# Altium project flatsat_platform.PrjPcb (part 1 of 2)
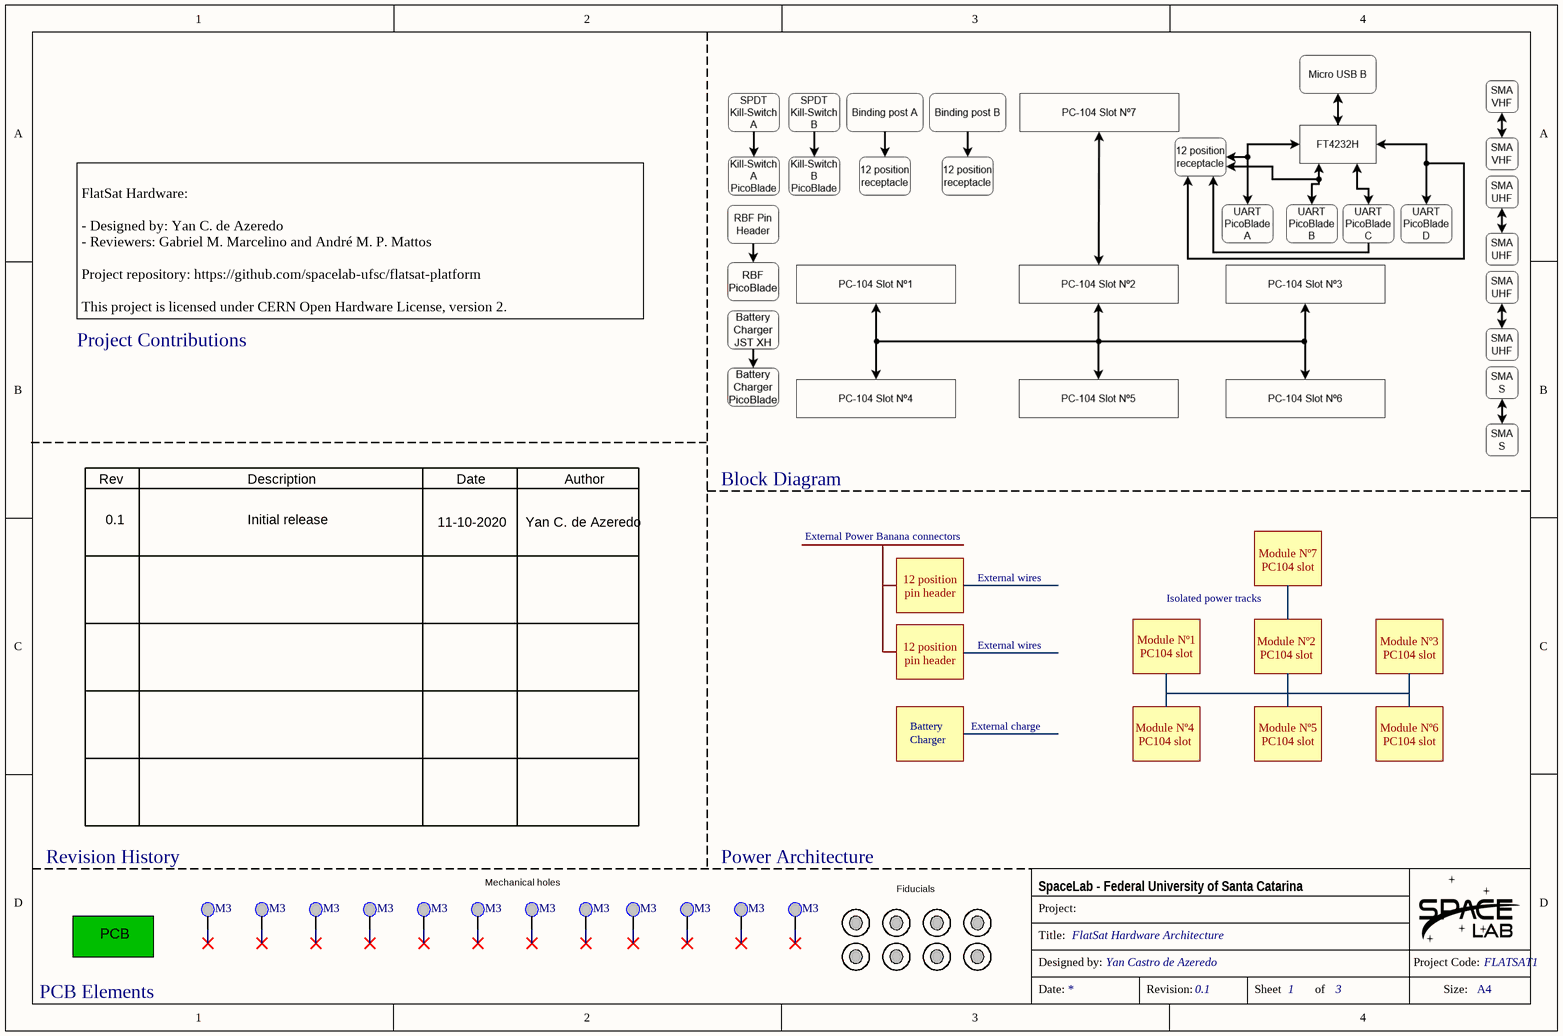
[diagram p0: 0_architecture.SchDoc]
DesignedBy: Yan Castro de Azeredo; ProjectCode: FLATSAT1; Revision: 0.1
3 sheets, 109 parts. Net scope: global (net labels, ports and power ports of the same name join across sheets).
Board file: board_layout.PcbDoc
Sheets:
  0_architecture.SchDoc
  1_flatsat_interfaces.SchDoc
  2_usb_debug.SchDoc

## Sheet 0_architecture.SchDoc: FlatSat Hardware Architecture
size A4; Organization: UFSC; DocumentNumber: 1; SheetNumber: 1; SheetTotal: 3; ProjectCode: FLATSAT1

### Parts
_PCB1  PCB spec  (value not drawn)  (no BOM)
FD1  Fiducial 1.3  [Fiducial 1.3mm]  (value not drawn)  (no BOM)
FD2  Fiducial 1.3  [Fiducial 1.3mm]  (value not drawn)  (no BOM)
FD3  Fiducial 1.3  [Fiducial 1.3mm]  (value not drawn)  (no BOM)
FD4  Fiducial 1.3  [Fiducial 1.3mm]  (value not drawn)  (no BOM)
FD5  Fiducial 1.3  [Fiducial 1.3mm]  (value not drawn)  (no BOM)
FD6  Fiducial 1.3  [Fiducial 1.3mm]  (value not drawn)  (no BOM)
FD7  Fiducial 1.3  [Fiducial 1.3mm]  (value not drawn)  (no BOM)
FD8  Fiducial 1.3  [Fiducial 1.3mm]  (value not drawn)  (no BOM)
MEC1  M3  [M3 hole]  (no BOM)
MEC2  M3  [M3 hole]  (no BOM)
MEC3  M3  [M3 hole]  (no BOM)
MEC4  M3  [M3 hole]  (no BOM)
MEC5  M3  [M3 hole]  (no BOM)
MEC6  M3  [M3 hole]  (no BOM)
MEC7  M3  [M3 hole]  (no BOM)
MEC8  M3  [M3 hole]  (no BOM)
MEC9  M3  [M3 hole]  (no BOM)
MEC10  M3  [M3 hole]  (no BOM)
MEC11  M3  [M3 hole]  (no BOM)
MEC12  M3  [M3 hole]  (no BOM)

### Nets

Not connected (* = marked no-connect by the designer): MEC1 0*; MEC2 0*; MEC3 0*; MEC4 0*; MEC5 0*; MEC6 0*; MEC7 0*; MEC8 0*; MEC9 0*; MEC10 0*; MEC11 0*; MEC12 0*

### Notes on the sheet
- FlatSat Hardware:
  - Designed by: Yan C. de Azeredo
  - Reviewers: Gabriel M. Marcelino and André M. P. Mattos
  Project repository: https://github.com/spacelab-ufsc/flatsat-platform
  This project is licensed under CERN Open Hardware License, version 2.
- Project Contributions
- Rev
- Description
- Date
- Author
- Block Diagram
- 0.1
- Initial release
- 11-10-2020
- Yan C. de Azeredo
- External Power Banana connectors
- External wires
- Module Nº7
  PC104 slot
- 12 position
  pin header
- Module Nº1
  PC104 slot
- Isolated power tracks
- Module Nº2
  PC104 slot
- Module Nº3
  PC104 slot
- Battery
- Charger
- External charge
- Module Nº4
  PC104 slot
- Module Nº5
  PC104 slot
- Module Nº6
  PC104 slot
- Revision History
- Mechanical holes
- Power Architecture
- Fiducials
- (near _PCB1) PCB Elements
- Project:
- SpaceLab - Federal University of Santa Catarina
- Title:
- Designed by:
- Project Code:
- Date:
- Revision:
- Sheet
- of
- Size:
- A4

### Library data of the parts
_PCB1 = PCB
FD1-FD8 = Fiducial 1.3: Fiducial 1.3mm
MEC1-MEC12 = M3 hole

## Sheet 1_flatsat_interfaces.SchDoc: FlatSat Main Interfaces and Connectors
size A2; ProjectCode: FLATSAT1; DocumentNumber: 2; SheetNumber: 2; SheetTotal: 3
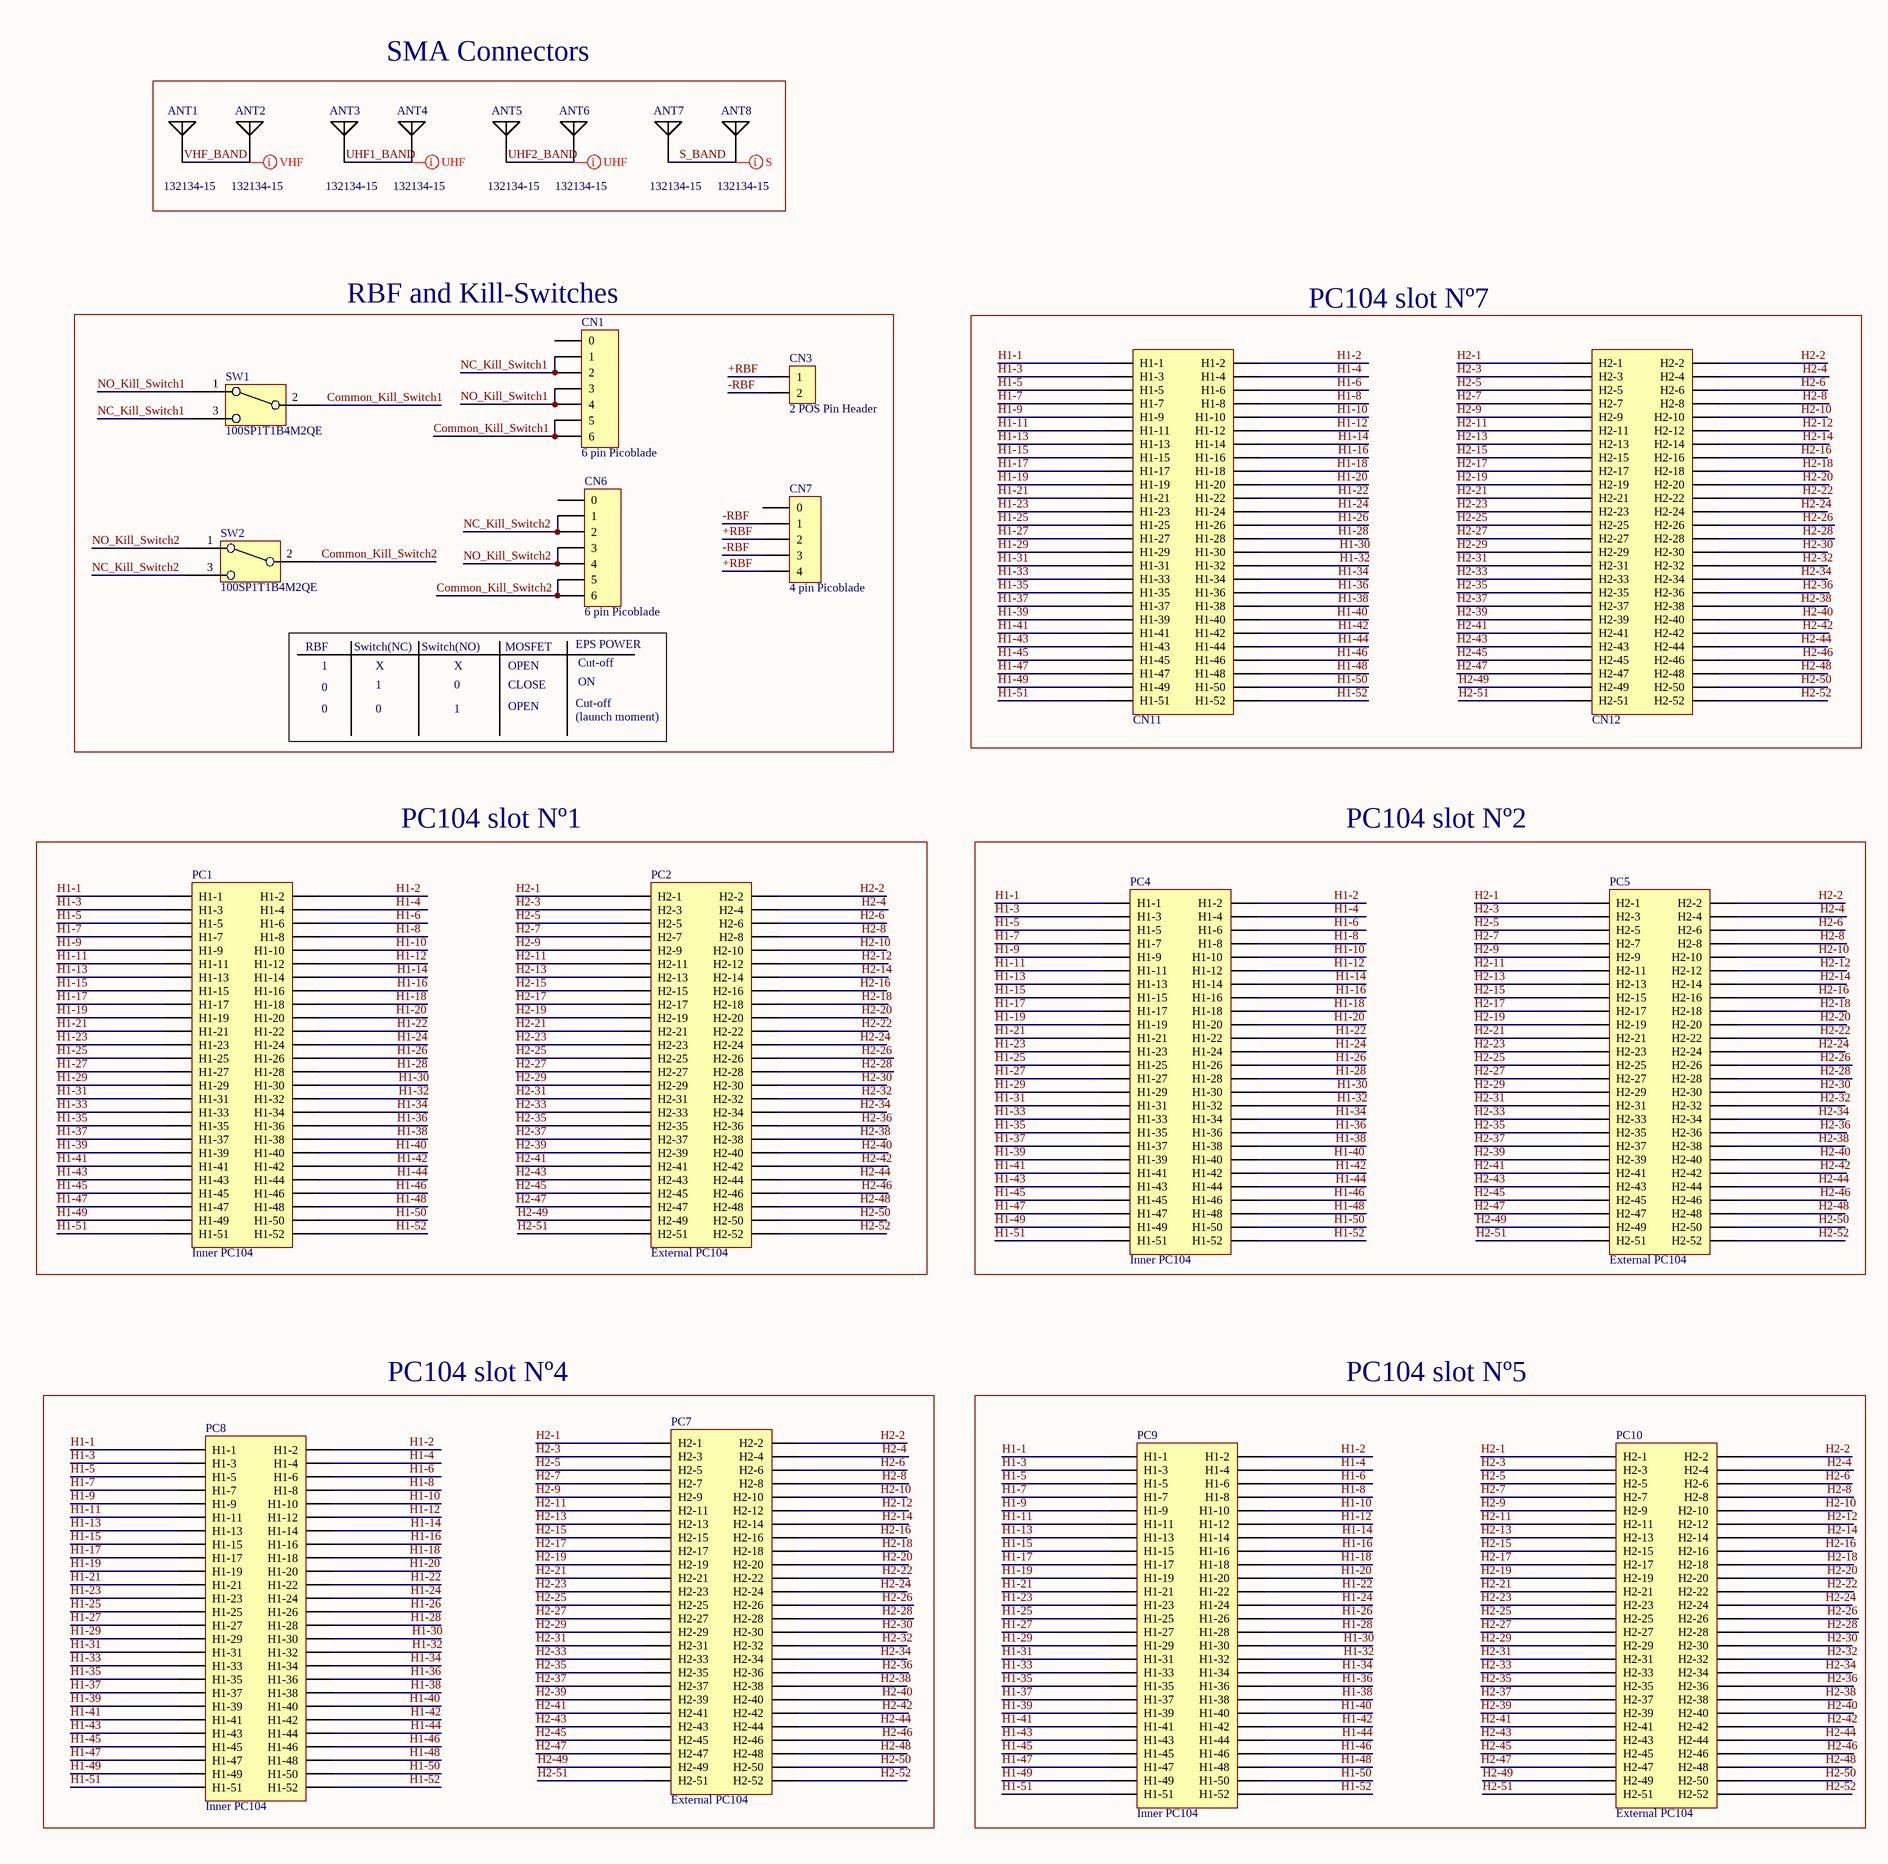
[diagram p1: 1_flatsat_interfaces.SchDoc, left]
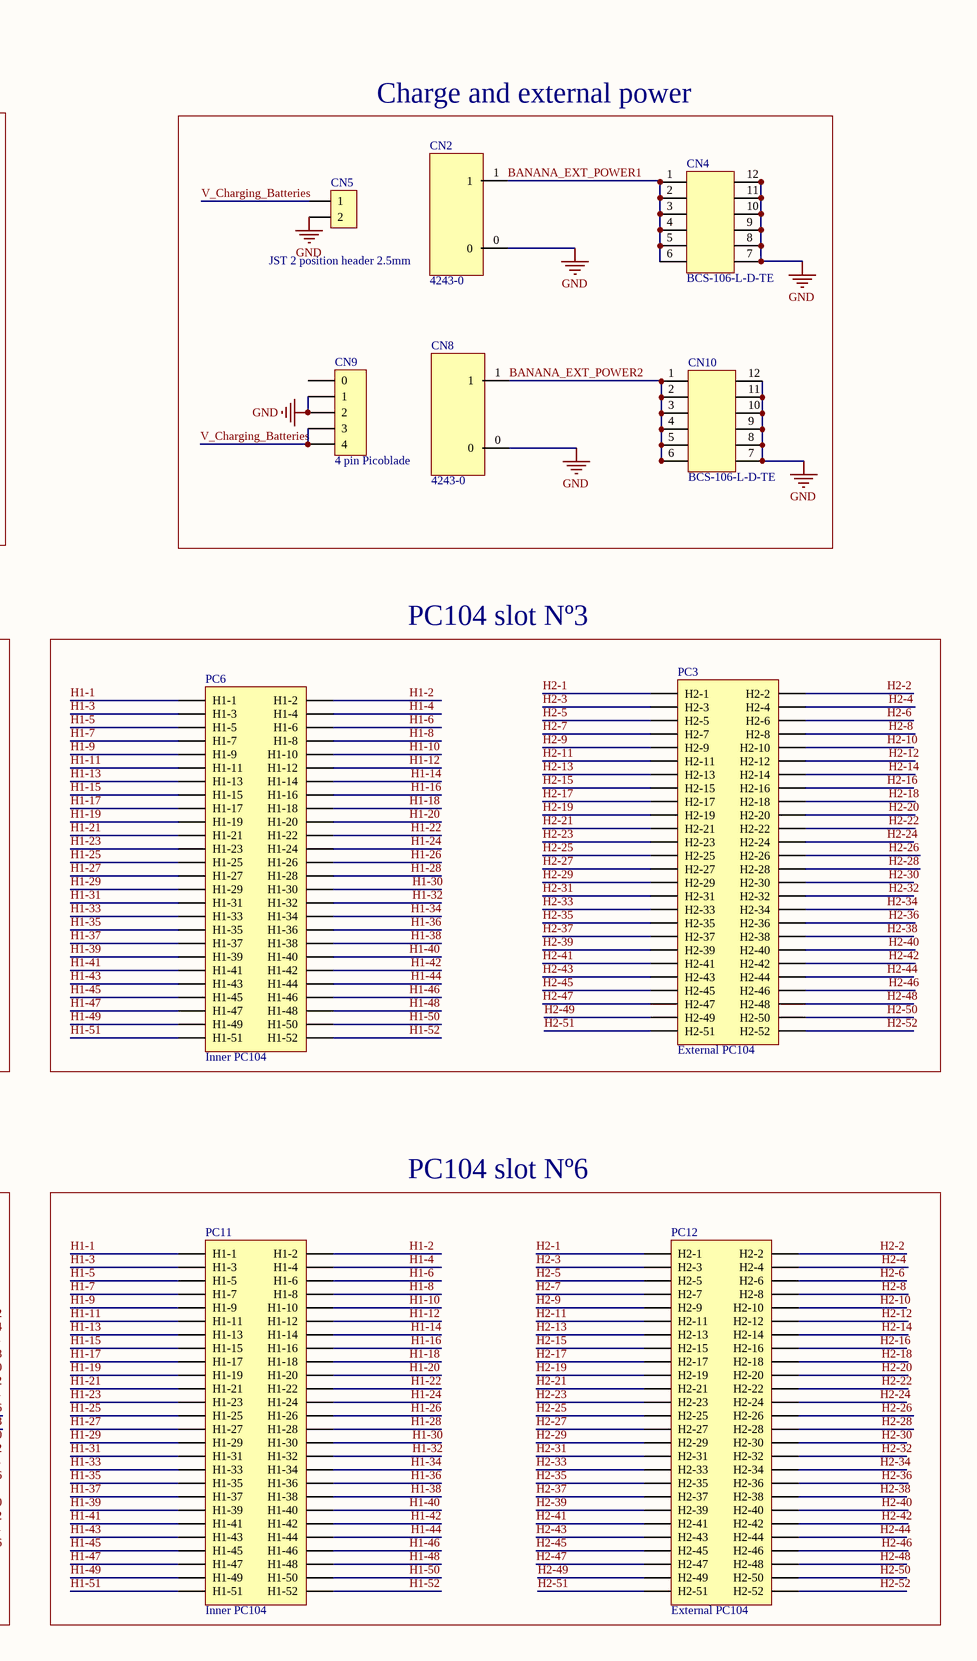
[diagram p2: 1_flatsat_interfaces.SchDoc, right]

### Parts
ANT1  132134-15  [132134-15]
ANT2  132134-15  [132134-15]
ANT3  132134-15  [132134-15]
ANT4  132134-15  [132134-15]
ANT5  132134-15  [132134-15]
ANT6  132134-15  [132134-15]
ANT7  132134-15  [132134-15]
ANT8  132134-15  [132134-15]
CN1  6 pin Picoblade  [PICO BLADE 0533980671]
CN2  4243-0  [4243-0]
CN3  2 POS Pin Header  [CONN HEADER VERT 2POS 2.54mm]
CN4  BCS-106-L-D-TE  [BCS-106-L-D-TE]
CN5  JST 2 position header 2.5mm  [B2B-XH-A-M(LF)(SN)]
CN6  6 pin Picoblade  [PICO BLADE 0533980671]
CN7  4 pin Picoblade  [PICO BLADE 0533980471]
CN8  4243-0  [4243-0]
CN9  4 pin Picoblade  [PICO BLADE 0533980471]
CN10  BCS-106-L-D-TE  [BCS-106-L-D-TE]
CN11  CONN RCPT 52POS 0.1 GOLD PCB  [Inner_SSW-126-01-G-D_testboard]  (value not drawn)
CN12  CONN RCPT 52POS 0.1 GOLD PCB  [external_SSW-126-01-G-D _testboard]  (value not drawn)
PC1  Inner PC104  [Inner_SSW-126-01-G-D]
PC2  External PC104  [external_SSW-126-01-G-D]
PC3  External PC104  [external_SSW-126-01-G-D]
PC4  Inner PC104  [Inner_SSW-126-01-G-D]
PC5  External PC104  [external_SSW-126-01-G-D]
PC6  Inner PC104  [Inner_SSW-126-01-G-D]
PC7  External PC104  [external_SSW-126-01-G-D]
PC8  Inner PC104  [Inner_SSW-126-01-G-D]
PC9  Inner PC104  [Inner_SSW-126-01-G-D]
PC10  External PC104  [external_SSW-126-01-G-D]
PC11  Inner PC104  [Inner_SSW-126-01-G-D]
PC12  External PC104  [external_SSW-126-01-G-D]
SW1  100SP1T1B4M2QE  [Toggle Switch SPDT Through Hole]
SW2  100SP1T1B4M2QE  [Toggle Switch SPDT Through Hole]

### Blocks framed on the sheet
SMA Connectors: ANT1-ANT8
RBF and Kill-Switches: CN1 CN3 CN6 CN7 SW1 SW2
PC104 slot Nº7: CN11 CN12
Charge and external power: CN2 CN4 CN5 CN8-CN10
PC104 slot Nº1: PC1 PC2
PC104 slot Nº2: PC4 PC5
PC104 slot Nº3: PC3 PC6
PC104 slot Nº4: PC7 PC8
PC104 slot Nº5: PC9 PC10
PC104 slot Nº6: PC11 PC12

### Nets
GND: CN2.0 CN4.7 CN4.8 CN4.9 CN4.10 CN4.11 CN4.12 CN5.2 CN8.0 CN9.1 CN9.2 CN10.7 CN10.8 CN10.9 CN10.10 CN10.11 CN10.12
+RBF: CN3.1 CN7.2 CN7.4
-RBF: CN3.2 CN7.1 CN7.3
BANANA_EXT_POWER1: CN2.1 CN4.1 CN4.2 CN4.3 CN4.4 CN4.5 CN4.6
BANANA_EXT_POWER2: CN8.1 CN10.1 CN10.2 CN10.3 CN10.4 CN10.5 CN10.6
Common_Kill_Switch1: CN1.5 CN1.6 SW1.2(C)
Common_Kill_Switch2: CN6.5 CN6.6 SW2.2(C)
H1-1: CN11.H1-1 PC1.H1-1 PC4.H1-1 PC6.H1-1 PC8.H1-1 PC9.H1-1 PC11.H1-1
H1-2: CN11.H1-2 PC1.H1-2 PC4.H1-2 PC6.H1-2 PC8.H1-2 PC9.H1-2 PC11.H1-2
H1-3: CN11.H1-3 PC1.H1-3 PC4.H1-3 PC6.H1-3 PC8.H1-3 PC9.H1-3 PC11.H1-3
H1-4: CN11.H1-4 PC1.H1-4 PC4.H1-4 PC6.H1-4 PC8.H1-4 PC9.H1-4 PC11.H1-4
H1-5: CN11.H1-5 PC1.H1-5 PC4.H1-5 PC6.H1-5 PC8.H1-5 PC9.H1-5 PC11.H1-5
H1-6: CN11.H1-6 PC1.H1-6 PC4.H1-6 PC6.H1-6 PC8.H1-6 PC9.H1-6 PC11.H1-6
H1-7: CN11.H1-7 PC1.H1-7 PC4.H1-7 PC6.H1-7 PC8.H1-7 PC9.H1-7 PC11.H1-7
H1-8: CN11.H1-8 PC1.H1-8 PC4.H1-8 PC6.H1-8 PC8.H1-8 PC9.H1-8 PC11.H1-8
H1-9: CN11.H1-9 PC1.H1-9 PC4.H1-9 PC6.H1-9 PC8.H1-9 PC9.H1-9 PC11.H1-9
H1-10: CN11.H1-10 PC1.H1-10 PC4.H1-10 PC6.H1-10 PC8.H1-10 PC9.H1-10 PC11.H1-10
H1-11: CN11.H1-11 PC1.H1-11 PC4.H1-11 PC6.H1-11 PC8.H1-11 PC9.H1-11 PC11.H1-11
H1-12: CN11.H1-12 PC1.H1-12 PC4.H1-12 PC6.H1-12 PC8.H1-12 PC9.H1-12 PC11.H1-12
H1-13: CN11.H1-13 PC1.H1-13 PC4.H1-13 PC6.H1-13 PC8.H1-13 PC9.H1-13 PC11.H1-13
H1-14: CN11.H1-14 PC1.H1-14 PC4.H1-14 PC6.H1-14 PC8.H1-14 PC9.H1-14 PC11.H1-14
H1-15: CN11.H1-15 PC1.H1-15 PC4.H1-15 PC6.H1-15 PC8.H1-15 PC9.H1-15 PC11.H1-15
H1-16: CN11.H1-16 PC1.H1-16 PC4.H1-16 PC6.H1-16 PC8.H1-16 PC9.H1-16 PC11.H1-16
H1-17: CN11.H1-17 PC1.H1-17 PC4.H1-17 PC6.H1-17 PC8.H1-17 PC9.H1-17 PC11.H1-17
H1-18: CN11.H1-18 PC1.H1-18 PC4.H1-18 PC6.H1-18 PC8.H1-18 PC9.H1-18 PC11.H1-18
H1-19: CN11.H1-19 PC1.H1-19 PC4.H1-19 PC6.H1-19 PC8.H1-19 PC9.H1-19 PC11.H1-19
H1-20: CN11.H1-20 PC1.H1-20 PC4.H1-20 PC6.H1-20 PC8.H1-20 PC9.H1-20 PC11.H1-20
H1-21: CN11.H1-21 PC1.H1-21 PC4.H1-21 PC6.H1-21 PC8.H1-21 PC9.H1-21 PC11.H1-21
H1-22: CN11.H1-22 PC1.H1-22 PC4.H1-22 PC6.H1-22 PC8.H1-22 PC9.H1-22 PC11.H1-22
H1-23: CN11.H1-23 PC1.H1-23 PC4.H1-23 PC6.H1-23 PC8.H1-23 PC9.H1-23 PC11.H1-23
H1-24: CN11.H1-24 PC1.H1-24 PC4.H1-24 PC6.H1-24 PC8.H1-24 PC9.H1-24 PC11.H1-24
H1-25: CN11.H1-25 PC1.H1-25 PC4.H1-25 PC6.H1-25 PC8.H1-25 PC9.H1-25 PC11.H1-25
H1-26: CN11.H1-26 PC1.H1-26 PC4.H1-26 PC6.H1-26 PC8.H1-26 PC9.H1-26 PC11.H1-26
H1-27: CN11.H1-27 PC1.H1-27 PC4.H1-27 PC6.H1-27 PC8.H1-27 PC9.H1-27 PC11.H1-27
H1-28: CN11.H1-28 PC1.H1-28 PC4.H1-28 PC6.H1-28 PC8.H1-28 PC9.H1-28 PC11.H1-28
H1-29: CN11.H1-29 PC1.H1-29 PC4.H1-29 PC6.H1-29 PC8.H1-29 PC9.H1-29 PC11.H1-29
H1-30: CN11.H1-30 PC1.H1-30 PC4.H1-30 PC6.H1-30 PC8.H1-30 PC9.H1-30 PC11.H1-30
H1-31: CN11.H1-31 PC1.H1-31 PC4.H1-31 PC6.H1-31 PC8.H1-31 PC9.H1-31 PC11.H1-31
H1-32: CN11.H1-32 PC1.H1-32 PC4.H1-32 PC6.H1-32 PC8.H1-32 PC9.H1-32 PC11.H1-32
H1-33: CN11.H1-33 PC1.H1-33 PC4.H1-33 PC6.H1-33 PC8.H1-33 PC9.H1-33 PC11.H1-33
H1-34: CN11.H1-34 PC1.H1-34 PC4.H1-34 PC6.H1-34 PC8.H1-34 PC9.H1-34 PC11.H1-34
H1-35: CN11.H1-35 PC1.H1-35 PC4.H1-35 PC6.H1-35 PC8.H1-35 PC9.H1-35 PC11.H1-35
H1-36: CN11.H1-36 PC1.H1-36 PC4.H1-36 PC6.H1-36 PC8.H1-36 PC9.H1-36 PC11.H1-36
H1-37: CN11.H1-37 PC1.H1-37 PC4.H1-37 PC6.H1-37 PC8.H1-37 PC9.H1-37 PC11.H1-37
H1-38: CN11.H1-38 PC1.H1-38 PC4.H1-38 PC6.H1-38 PC8.H1-38 PC9.H1-38 PC11.H1-38
H1-39: CN11.H1-39 PC1.H1-39 PC4.H1-39 PC6.H1-39 PC8.H1-39 PC9.H1-39 PC11.H1-39
H1-40: CN11.H1-40 PC1.H1-40 PC4.H1-40 PC6.H1-40 PC8.H1-40 PC9.H1-40 PC11.H1-40
H1-41: CN11.H1-41 PC1.H1-41 PC4.H1-41 PC6.H1-41 PC8.H1-41 PC9.H1-41 PC11.H1-41
H1-42: CN11.H1-42 PC1.H1-42 PC4.H1-42 PC6.H1-42 PC8.H1-42 PC9.H1-42 PC11.H1-42
H1-43: CN11.H1-43 PC1.H1-43 PC4.H1-43 PC6.H1-43 PC8.H1-43 PC9.H1-43 PC11.H1-43
H1-44: CN11.H1-44 PC1.H1-44 PC4.H1-44 PC6.H1-44 PC8.H1-44 PC9.H1-44 PC11.H1-44
H1-45: CN11.H1-45 PC1.H1-45 PC4.H1-45 PC6.H1-45 PC8.H1-45 PC9.H1-45 PC11.H1-45
H1-46: CN11.H1-46 PC1.H1-46 PC4.H1-46 PC6.H1-46 PC8.H1-46 PC9.H1-46 PC11.H1-46
H1-47: CN11.H1-47 PC1.H1-47 PC4.H1-47 PC6.H1-47 PC8.H1-47 PC9.H1-47 PC11.H1-47
H1-48: CN11.H1-48 PC1.H1-48 PC4.H1-48 PC6.H1-48 PC8.H1-48 PC9.H1-48 PC11.H1-48
H1-49: CN11.H1-49 PC1.H1-49 PC4.H1-49 PC6.H1-49 PC8.H1-49 PC9.H1-49 PC11.H1-49
H1-50: CN11.H1-50 PC1.H1-50 PC4.H1-50 PC6.H1-50 PC8.H1-50 PC9.H1-50 PC11.H1-50
H1-51: CN11.H1-51 PC1.H1-51 PC4.H1-51 PC6.H1-51 PC8.H1-51 PC9.H1-51 PC11.H1-51
H1-52: CN11.H1-52 PC1.H1-52 PC4.H1-52 PC6.H1-52 PC8.H1-52 PC9.H1-52 PC11.H1-52
H2-1: CN12.H2-1 PC2.H2-1 PC3.H2-1 PC5.H2-1 PC7.H2-1 PC10.H2-1 PC12.H2-1
H2-2: CN12.H2-2 PC2.H2-2 PC3.H2-2 PC5.H2-2 PC7.H2-2 PC10.H2-2 PC12.H2-2
H2-3: CN12.H2-3 PC2.H2-3 PC3.H2-3 PC5.H2-3 PC7.H2-3 PC10.H2-3 PC12.H2-3
H2-4: CN12.H2-4 PC2.H2-4 PC3.H2-4 PC5.H2-4 PC7.H2-4 PC10.H2-4 PC12.H2-4
H2-5: CN12.H2-5 PC2.H2-5 PC3.H2-5 PC5.H2-5 PC7.H2-5 PC10.H2-5 PC12.H2-5
H2-6: CN12.H2-6 PC2.H2-6 PC3.H2-6 PC5.H2-6 PC7.H2-6 PC10.H2-6 PC12.H2-6
H2-7: CN12.H2-7 PC2.H2-7 PC3.H2-7 PC5.H2-7 PC7.H2-7 PC10.H2-7 PC12.H2-7
H2-8: CN12.H2-8 PC2.H2-8 PC3.H2-8 PC5.H2-8 PC7.H2-8 PC10.H2-8 PC12.H2-8
H2-9: CN12.H2-9 PC2.H2-9 PC3.H2-9 PC5.H2-9 PC7.H2-9 PC10.H2-9 PC12.H2-9
H2-10: CN12.H2-10 PC2.H2-10 PC3.H2-10 PC5.H2-10 PC7.H2-10 PC10.H2-10 PC12.H2-10
H2-11: CN12.H2-11 PC2.H2-11 PC3.H2-11 PC5.H2-11 PC7.H2-11 PC10.H2-11 PC12.H2-11
H2-12: CN12.H2-12 PC2.H2-12 PC3.H2-12 PC5.H2-12 PC7.H2-12 PC10.H2-12 PC12.H2-12
H2-13: CN12.H2-13 PC2.H2-13 PC3.H2-13 PC5.H2-13 PC7.H2-13 PC10.H2-13 PC12.H2-13
H2-14: CN12.H2-14 PC2.H2-14 PC3.H2-14 PC5.H2-14 PC7.H2-14 PC10.H2-14 PC12.H2-14
H2-15: CN12.H2-15 PC2.H2-15 PC3.H2-15 PC5.H2-15 PC7.H2-15 PC10.H2-15 PC12.H2-15
H2-16: CN12.H2-16 PC2.H2-16 PC3.H2-16 PC5.H2-16 PC7.H2-16 PC10.H2-16 PC12.H2-16
H2-17: CN12.H2-17 PC2.H2-17 PC3.H2-17 PC5.H2-17 PC7.H2-17 PC10.H2-17 PC12.H2-17
H2-18: CN12.H2-18 PC2.H2-18 PC3.H2-18 PC5.H2-18 PC7.H2-18 PC10.H2-18 PC12.H2-18
H2-19: CN12.H2-19 PC2.H2-19 PC3.H2-19 PC5.H2-19 PC7.H2-19 PC10.H2-19 PC12.H2-19
H2-20: CN12.H2-20 PC2.H2-20 PC3.H2-20 PC5.H2-20 PC7.H2-20 PC10.H2-20 PC12.H2-20
H2-21: CN12.H2-21 PC2.H2-21 PC3.H2-21 PC5.H2-21 PC7.H2-21 PC10.H2-21 PC12.H2-21
H2-22: CN12.H2-22 PC2.H2-22 PC3.H2-22 PC5.H2-22 PC7.H2-22 PC10.H2-22 PC12.H2-22
H2-23: CN12.H2-23 PC2.H2-23 PC3.H2-23 PC5.H2-23 PC7.H2-23 PC10.H2-23 PC12.H2-23
H2-24: CN12.H2-24 PC2.H2-24 PC3.H2-24 PC5.H2-24 PC7.H2-24 PC10.H2-24 PC12.H2-24
H2-25: CN12.H2-25 PC2.H2-25 PC3.H2-25 PC5.H2-25 PC7.H2-25 PC10.H2-25 PC12.H2-25
H2-26: CN12.H2-26 PC2.H2-26 PC3.H2-26 PC5.H2-26 PC7.H2-26 PC10.H2-26 PC12.H2-26
H2-27: CN12.H2-27 PC2.H2-27 PC3.H2-27 PC5.H2-27 PC7.H2-27 PC10.H2-27 PC12.H2-27
H2-28: CN12.H2-28 PC2.H2-28 PC3.H2-28 PC5.H2-28 PC7.H2-28 PC10.H2-28 PC12.H2-28
H2-29: CN12.H2-29 PC2.H2-29 PC3.H2-29 PC5.H2-29 PC7.H2-29 PC10.H2-29 PC12.H2-29
H2-30: CN12.H2-30 PC2.H2-30 PC3.H2-30 PC5.H2-30 PC7.H2-30 PC10.H2-30 PC12.H2-30
H2-31: CN12.H2-31 PC2.H2-31 PC3.H2-31 PC5.H2-31 PC7.H2-31 PC10.H2-31 PC12.H2-31
H2-32: CN12.H2-32 PC2.H2-32 PC3.H2-32 PC5.H2-32 PC7.H2-32 PC10.H2-32 PC12.H2-32
H2-33: CN12.H2-33 PC2.H2-33 PC3.H2-33 PC5.H2-33 PC7.H2-33 PC10.H2-33 PC12.H2-33
H2-34: CN12.H2-34 PC2.H2-34 PC3.H2-34 PC5.H2-34 PC7.H2-34 PC10.H2-34 PC12.H2-34
H2-35: CN12.H2-35 PC2.H2-35 PC3.H2-35 PC5.H2-35 PC7.H2-35 PC10.H2-35 PC12.H2-35
H2-36: CN12.H2-36 PC2.H2-36 PC3.H2-36 PC5.H2-36 PC7.H2-36 PC10.H2-36 PC12.H2-36
H2-37: CN12.H2-37 PC2.H2-37 PC3.H2-37 PC5.H2-37 PC7.H2-37 PC10.H2-37 PC12.H2-37
H2-38: CN12.H2-38 PC2.H2-38 PC3.H2-38 PC5.H2-38 PC7.H2-38 PC10.H2-38 PC12.H2-38
H2-39: CN12.H2-39 PC2.H2-39 PC3.H2-39 PC5.H2-39 PC7.H2-39 PC10.H2-39 PC12.H2-39
H2-40: CN12.H2-40 PC2.H2-40 PC3.H2-40 PC5.H2-40 PC7.H2-40 PC10.H2-40 PC12.H2-40
H2-41: CN12.H2-41 PC2.H2-41 PC3.H2-41 PC5.H2-41 PC7.H2-41 PC10.H2-41 PC12.H2-41
H2-42: CN12.H2-42 PC2.H2-42 PC3.H2-42 PC5.H2-42 PC7.H2-42 PC10.H2-42 PC12.H2-42
H2-43: CN12.H2-43 PC2.H2-43 PC3.H2-43 PC5.H2-43 PC7.H2-43 PC10.H2-43 PC12.H2-43
H2-44: CN12.H2-44 PC2.H2-44 PC3.H2-44 PC5.H2-44 PC7.H2-44 PC10.H2-44 PC12.H2-44
H2-45: CN12.H2-45 PC2.H2-45 PC3.H2-45 PC5.H2-45 PC7.H2-45 PC10.H2-45 PC12.H2-45
H2-46: CN12.H2-46 PC2.H2-46 PC3.H2-46 PC5.H2-46 PC7.H2-46 PC10.H2-46 PC12.H2-46
H2-47: CN12.H2-47 PC2.H2-47 PC3.H2-47 PC5.H2-47 PC7.H2-47 PC10.H2-47 PC12.H2-47
H2-48: CN12.H2-48 PC2.H2-48 PC3.H2-48 PC5.H2-48 PC7.H2-48 PC10.H2-48 PC12.H2-48
H2-49: CN12.H2-49 PC2.H2-49 PC3.H2-49 PC5.H2-49 PC7.H2-49 PC10.H2-49 PC12.H2-49
H2-50: CN12.H2-50 PC2.H2-50 PC3.H2-50 PC5.H2-50 PC7.H2-50 PC10.H2-50 PC12.H2-50
H2-51: CN12.H2-51 PC2.H2-51 PC3.H2-51 PC5.H2-51 PC7.H2-51 PC10.H2-51 PC12.H2-51
H2-52: CN12.H2-52 PC2.H2-52 PC3.H2-52 PC5.H2-52 PC7.H2-52 PC10.H2-52 PC12.H2-52
NC_Kill_Switch1: CN1.1 CN1.2 SW1.3(NO)
NC_Kill_Switch2: CN6.1 CN6.2 SW2.3(NO)
NO_Kill_Switch1: CN1.3 CN1.4 SW1.1(NC)
NO_Kill_Switch2: CN6.3 CN6.4 SW2.1(NC)
S_BAND: ANT7.1 ANT8.1
UHF1_BAND: ANT3.1 ANT4.1
UHF2_BAND: ANT5.1 ANT6.1
V_Charging_Batteries: CN5.1 CN9.3 CN9.4
VHF_BAND: ANT1.1 ANT2.1

Not connected (* = marked no-connect by the designer): CN1 0; CN6 0; CN7 0; CN9 0

### Layout directives
net class VHF: VHF_BAND
net class UHF: UHF1_BAND, UHF2_BAND
net class S: S_BAND

### Notes on the sheet
- RBF
- 1
- 0
- Switch(NC)
- X
- Switch(NO)
- MOSFET
- OPEN
- CLOSE
- (near CN6) EPS POWER
- Cut-off
- ON
- (launch moment)
- Title:
- Project:
- SpaceLab - Federal University of Santa Catarina
- Date:
- Engineer:
- Revision:
- Sheet
- of
- Project Code:
- Size:
- A2

### Library data of the parts
ANT1-ANT8 = 132134-15: RF COAXIAL, SMA, STRAIGHT JACK, PCB; Connector Type:SMA Coaxial; Connector Body Style:Straight Jack; Coaxial Termination:Solder; Impedance:50ohm; Coaxial Cable Types:-; Contact Material:Brass; Contact Plating:Gold Plated Contacts; Body Material: Brass; Body Plating: Gold; Dielectric Material: PTFE; Connector Type: SMA,Socket; Max Frequency: 12.4GHz; Polarity: Standard; Impedance: 50R; Mating Cycles: 500; Mount Type: *; Manufacturer: *; Supplier 1: Digi-Key; Manufacturer Part Number: 132134-15; RoHS: Yes; Category: RF / Coaxial Connectors; Stock 1: 25238; Pricing 1: 1=9.73000, 10=9.30600, 25=8.46000, 50=8.03700, 100=7.82550, 250=6.97952, 500=6.55650, 1000=5.79510, 2500=5.49900 (USD); Mount: Surface Mount,Through Hole; Case/Package: SMA; Housing Color: Gold; Contact Material: Copper; Contact Plating: Gold; Min Operating Temperature: -65°C; Max Operating Temperature: 165°C; Termination: Solder; Orientation: Straight; Package Quantity: 1; Fastening Type: Threaded; Packaging: Bulk; ComponentLink1URL: https://datasheet.ciiva.com/646/132134-15-646945.pdf?src-supplier=Digi-Key; ComponentLink1Description: https://datasheet.ciiva.com/646/132134-15-646945.pdf?src-supplier=Digi-Key; ComponentLink2URL: https://datasheet.ciiva.com/24241/132134-15-customer-drawing-24241080.pdf?src-supplier=Mouser; ComponentLink2Description: https://datasheet.ciiva.com/24241/132134-15-customer-drawing-24241080.pdf?src-supplier=Mouser; Value: *; Supplier Part Number 1: ACX1962-ND
CN1 CN6 = 53398-0671: 1.25mm Pitch PicoBlade™ Header, Surface Mount, Vertical, 6 Circuits; Manufacturer: Molex; Body Plating: Tin; Contact Resistance: 20mR; Voltage Rating: 125V; Current Rating: 1A; Number of Positions: 6; Insulation Resistance: 100MR; Gender: Male; Glow Wire Compliant: Non-compliant; Supplier 1: Digi-Key; Supplier Part Number 1: WM7610DKR-ND; Stock 1: 21086; Pricing 1: 1=1.39, 10=1.26, 100=1.0802, 500=0.90014 (USD); Mount: Surface Mount; Color: Natural; Contact Plating: Tin; Contact Material: Bronze,Tin; Housing Color: Natural; Housing Material: Nylon; Min Operating Temperature: -40°C; Max Operating Temperature: 85°C; Packaging: Tape and Reel; Number of Rows: 1; Voltage Rating (AC): 125V; Package Quantity: 1000; Termination: Solder; Number of Contacts: 6; Working Voltage: 125V; Orientation: Vertical; Number of Circuits: 6; Voltage Rating (DC): 125V; Lead Pitch: 1.25mm; Pitch: 1.25mm; Radiation Hardening: No; REACH SVHC: Unknown; Lead Free: Lead Free; Flammability Rating: UL94 V-0; ComponentLink1URL: https://www.molex.com/pdm_docs/sd/533980671_sd.pdf?src-supplier=Digi-Key; ComponentLink1Description: https://www.molex.com/pdm_docs/sd/533980671_sd.pdf?src-supplier=Digi-Key; Supplier 2: Mouser; Supplier Part Number 2: 538-53398-0671; Stock 2: 26; Pricing 2: 1=1.15, 10=1.01, 100=0.864, 500=0.727, 1000=0.427, 2000=0.374 (USD); Manufacturer Part Number: 53398-0671
CN2 CN8 = 4243-0: POMONA, 4243-0, Binding Post, 4243 Series, 15 A, 60 VDC, Tin Plated Contacts, Brass, Black; Manufacturer: Pomona Electronics; Voltage Rating: 2.5kV; Current Rating: 15A; Voltage Rating (DC): 60V; Voltage Rating (AC): 30V; Insulation: Insulated; Number of Ports: 2; Hole Diameter: 0.1inch; Panel Thickness: 6.35mm; Supplier 1: Digi-Key; Manufacturer Part Number: 4243-0; RoHS: Yes; Category: Connectors; Stock 1: 327; Pricing 1: 1=8.99000, 25=8.54040, 50=8.09100, 100=7.73150 (USD); Mount: Panel; Number of Pins: 1; Contact Plating: Tin,Bright; Contact Material: Brass; Color: Black,Red; Housing Material: Polycarbonate; Housing Color: Black; Body Material: Brass; Insulation Material: Polycarbonate; Package Quantity: 5; Packaging: Bulk; Termination: Turret; Orientation: Straight; Max Current Rating: 15A; Length: 30.23mm; Depth: 11.18mm; REACH SVHC: No SVHC; Lead Free: Lead Free; ComponentLink1URL: https://datasheet.ciiva.com/1453/d4243-1-01-1453890.pdf?src-supplier=Element14; ComponentLink1Description: https://datasheet.ciiva.com/1453/d4243-1-01-1453890.pdf?src-supplier=Element14; ComponentLink2URL: https://datasheet.ciiva.com/16883/70198115-16883751.pdf?src-supplier=Allied+Electronics; ComponentLink2Description: https://datasheet.ciiva.com/16883/70198115-16883751.pdf?src-supplier=Allied+Electronics; ComponentLink3URL: https://datasheet.ciiva.com/30105/d4243-1-02-30105753.pdf?src-supplier=Onlinecomponents.com; ComponentLink3Description: https://datasheet.ciiva.com/30105/d4243-1-02-30105753.pdf?src-supplier=Onlinecomponents.com; Supplier Part Number 1: 501-1126-ND
CN3 = M20-9990245: M20 HDR, PIN, SIL, VERT, 2W; Manufacturer: Harwin; Number of Contacts: 2; Current Rating: 3A; Contact Resistance: 25mR; Mating Cycles: 300; Voltage Rating (AC): 750V; Insulation Resistance: 10GR; Gender: Male; Connector Type: Male Pin; Voltage: 50V; Pitch: 2.54mm; Supplier 1: Digi-Key; Supplier Part Number 1: 952-2261-ND; Stock 1: 27298; Pricing 1: 1=0.15, 10=0.136, 100=0.0841, 500=0.0696, 1000=0.0609, 5000=0.0522, 10000=0.05075 (USD); Mount: Through Hole; Case/Package: SIL; Weight: 0.25lb; Contact Plating: Gold; Contact Material: Brass,Bronze; Color: Black; Housing Color: Black; Housing Material: Nylon; Min Operating Temperature: -40°C; Max Operating Temperature: 105°C; Number of Rows: 1; Termination: Solder; Max Current Rating: 3A; Number of Poles: 2; Package Quantity: 1000; Packaging: Bag; Number of Positions: 2; Working Voltage: 750V; Orientation: Straight; Current: 3A; Length: 5.08mm; Height: 0.12inch; Lead Pitch: 2.54mm; Width: 0.25inch; Contact Mating Length: 0.24inch; Depth: 2.54mm; Radiation Hardening: No; REACH SVHC: No SVHC; ComponentLink1URL: http://www.farnell.com/datasheets/2368211.pdf?src-supplier=Element14; ComponentLink1Description: http://www.farnell.com/datasheets/2368211.pdf?src-supplier=Element14; ComponentLink2URL: http://uk.rs-online.com/webdocs/1388/0900766b81388728.pdf?src-supplier=RSComponents; ComponentLink2Description: http://uk.rs-online.com/webdocs/1388/0900766b81388728.pdf?src-supplier=RSComponents; ComponentLink3URL: https://cdn.harwin.com/pdfs/Harwin_PC_Connectors_M20.pdf?src-supplier=Digi-Key; ComponentLink3Description: https://cdn.harwin.com/pdfs/Harwin_PC_Connectors_M20.pdf?src-supplier=Digi-Key; ComponentLink4URL: http://www.mouser.com/ds/2/181/Harwin_Product_Catalog_page_206-1134556.pdf?src-supplier=Mouser; ComponentLink4Description: http://www.mouser.com/ds/2/181/Harwin_Product_Catalog_page_206-1134556.pdf?src-supplier=Mouser; Supplier 2: Mouser; Supplier Part Number 2: 855-M20-9990245; Stock 2: 26881; Pricing 2: 1=0.14, 10=0.083, 100=0.069, 1000=0.06, 2000=0.052, 10000=0.05 (USD); Manufacturer Part Number: M20-9990245
CN4 CN10 = BCS-106-L-D-TE: CONN RCPT 12POS 0.1 GOLD PCB; Manufacturer: Samtec; Number of Contacts: 12; Gender: Receptacle; Max Current Rating: 5.9A; Contact Resistance: 10mR; Max Voltage Rating (AC): 475V; Pitch: 2.54mm; Row Spacing: 0.1inch; Supplier 1: Digi-Key; Manufacturer Part Number: BCS-106-L-D-TE; RoHS: Yes; Category: Connectors; Stock 1: 7411; Pricing 1: 1=1.77000, 10=1.60200, 25=1.50360, 50=1.43820, 100=1.37290, 250=1.24216, 500=1.14408 (USD); Mount: Through Hole; Contact Plating: Gold; Contact Material: Bronze; Color: Black; Housing Color: Black; Housing Material: Polymer; Min Operating Temperature: -55°C; Max Operating Temperature: 125°C; Number of Rows: 2; Termination: Solder; Packaging: Rail/Tube; Connector Type: Receptacle; Number of Positions: 12; Orientation: Vertical; Length: 15.24mm; Depth: 5.08mm; Width: 5.08mm; Radiation Hardening: No; REACH SVHC: No SVHC; Lead Free: Lead Free; ComponentLink1URL: https://datasheet.ciiva.com/16706/bcs-16706444.pdf?src-supplier=Avnet+Europe; ComponentLink1Description: https://datasheet.ciiva.com/16706/bcs-16706444.pdf?src-supplier=Avnet+Europe; ComponentLink2URL: https://datasheet.ciiva.com/413/bcs-1xx-xxx-x-xx-xxx-mkt-413758.pdf?src-supplier=Digi-Key; ComponentLink2Description: https://datasheet.ciiva.com/413/bcs-1xx-xxx-x-xx-xxx-mkt-413758.pdf?src-supplier=Digi-Key; Supplier Part Number 1: SAM1008-06-ND
CN5 = B2B-XH-A-M(LF)(SN): CONN HEADER TOP 2POS 2.5MM GRN; Number of Positions: 2; Connector Type: Male Pin; Pitch: 0.098inch; Supplier 1: Digi-Key; Supplier Part Number 1: 455-2879-ND; Manufacturer: JST; Stock 1: 5564; Pricing 1: 1=0.17, 10=0.157, 100=0.0966, 500=0.07998, 1000=0.06999, 5000=0.05999, 10000=0.05832 (USD); Mount: Through Hole; Color: Natural; Contact Plating: Tin; Packaging: Bulk; Number of Rows: 1; Termination: Press-Fit; Fastening Type: Detent; Package Quantity: 1000; Manufacturer Part Number: B2B-XH-A-M(LF)(SN); ComponentLink1Description: http://www.jst-mfg.com/product/pdf/eng/eXH.pdf; ComponentLink1URL: http://www.jst-mfg.com/product/pdf/eng/eXH.pdf
CN7 CN9 = 0533980471: Connector Header Surface Mount 4 position 0.049" (1.25mm); Manufacturer: Molex; Manufacturer Part Number: 53398-0471; N of Positions: 4; Body Plating: Tin; Gender: Male; Current Rating: 1A; Voltage Rating: 125V; Contact Resistance: 20mR; Insulation Resistance: 100MR; Glow Wire Compliant: Non-compliant; Pitch: 1.25mm; Mount Type: SMD; Value: 0533980471; Supplier 1: Digi-Key; Supplier Part Number 1: WM7608CT-ND; Stock 1: 21236; Pricing 1: 1=1.19, 10=1.044, 100=0.901, 500=0.73716 (USD); Mount: Surface Mount; Contact Plating: Tin; Contact Material: Bronze,Tin,Brass; Color: Natural; Housing Color: Natural; Housing Material: Nylon; Min Operating Temperature: -40°C; Max Operating Temperature: 85°C; Number of Rows: 1; Packaging: Tape and Reel; Number of Positions: 4; Termination: Solder; Package Quantity: 1000; Voltage Rating (AC): 125V; Number of Contacts: 4; Working Voltage: 125V; Orientation: Vertical; Number of Circuits: 4; Voltage Rating (DC): 125V; Lead Pitch: 1.25mm; Radiation Hardening: No; Flammability Rating: UL94 V-0; REACH SVHC: Unknown; Lead Free: Lead Free; ComponentLink1URL: http://www.mouser.com/ds/2/276/0533980471_PCB_HEADERS-171069.pdf?src-supplier=Mouser; ComponentLink1Description: http://www.mouser.com/ds/2/276/0533980471_PCB_HEADERS-171069.pdf?src-supplier=Mouser; ComponentLink2URL: http://www.jameco.com/Jameco/Products/ProdDS/1932627.pdf?src-supplier=Jameco; ComponentLink2Description: http://www.jameco.com/Jameco/Products/ProdDS/1932627.pdf?src-supplier=Jameco; ComponentLink3URL: https://www.distrelec.biz/Web/Downloads/46/_e/gf116833-116846_e.pdf?mime=application%2Fpdf&src-supplier=Distrelec; ComponentLink3Description: https://www.distrelec.biz/Web/Downloads/46/_e/gf116833-116846_e.pdf?mime=application%2Fpdf&src-supplier=Distrelec; ComponentLink4URL: http://www.molex.com/webdocs/datasheets/pdf/en-us/0533980471_PCB_HEADERS.pdf?src-supplier=Element14; ComponentLink4Description: http://www.molex.com/webdocs/datasheets/pdf/en-us/0533980471_PCB_HEADERS.pdf?src-supplier=Element14; ComponentLink5URL: http://www.farnell.com/datasheets/1867381.pdf?src-supplier=Element14; ComponentLink5Description: http://www.farnell.com/datasheets/1867381.pdf?src-supplier=Element14; ComponentLink6URL: http://uk.rs-online.com/webdocs/13c4/0900766b813c4500.pdf?src-supplier=RSComponents; ComponentLink6Description: http://uk.rs-online.com/webdocs/13c4/0900766b813c4500.pdf?src-supplier=RSComponents; ComponentLink7URL: http://www.molex.com/webdocs/datasheets/pdf/en-us/0533980471_PCB_HEADERS.pdf?src-supplier=Farnell; ComponentLink7Description: http://www.molex.com/webdocs/datasheets/pdf/en-us/0533980471_PCB_HEADERS.pdf?src-supplier=Farnell; ComponentLink8URL: http://www.farnell.com/datasheets/2697809.pdf?src-supplier=Element14; ComponentLink8Description: http://www.farnell.com/datasheets/2697809.pdf?src-supplier=Element14; ComponentLink9URL: http://www.molex.com/webdocs/datasheets/pdf/en-us/0533980471_PCB_HEADERS.pdf?src-supplier=Avnet; ComponentLink9Description: http://www.molex.com/webdocs/datasheets/pdf/en-us/0533980471_PCB_HEADERS.pdf?src-supplier=Avnet; ComponentLink10URL: http://www.molex.com/webdocs/datasheets/pdf/en-us/0533980471_PCB_HEADERS.pdf?src-supplier=Avnet+Europe; ComponentLink10Description: http://www.molex.com/webdocs/datasheets/pdf/en-us/0533980471_PCB_HEADERS.pdf?src-supplier=Avnet+Europe; Supplier 2: Mouser; Supplier Part Number 2: 538-53398-0471; Stock 2: 43680; Pricing 2: 1=0.98, 10=0.832, 100=0.716, 500=0.6, 1000=0.391, 2000=0.342 (USD)
CN11 = Inner_Expansion_TestBoard_PC104: Conn Socket Strip SKT 52 POS 2.54mm Solder ST Thru-Hole; Manufacturer: Samtec; Manufacturer Part Number: SSW-126-01-G-D; Gender: Receptacle; Number of Contacts: 52; Connector Type: Receptacle,Socket; Mating Cycles: 100; Max Voltage Rating (AC): 550V; Max Current Rating: 5.5A; Contact Resistance: 10mR; Row Spacing: 0.1inch; Supplier 1: Mouser; RoHS: Yes; Category: Headers and Wire Housings; Stock 1: 72; Pricing 1: 1=6.95000, 10=6.17000, 25=5.80000, 100=5.30000, 250=4.64000, 500=4.22000 (USD); Mount: Through Hole; Contact Plating: Gold; Contact Material: Bronze; Color: Black; Housing Color: Black; Housing Material: Polymer; Min Operating Temperature: -55°C; Max Operating Temperature: 125°C; Termination: Solder; Number of Rows: 2; Number of Positions: 52; Packaging: Bulk; Orientation: Straight; Length: 66.55mm; Pitch: 2.54mm; Width: 4.95mm; Depth: 4.95mm; Lead Free: Lead Free; REACH SVHC: No SVHC; ComponentLink1URL: https://datasheet.ciiva.com/749/ssw-1xx-xx-xxx-x-xx-xxx-xx-mkt-749805.pdf?src-supplier=Digi-Key; ComponentLink1Description: https://datasheet.ciiva.com/749/ssw-1xx-xx-xxx-x-xx-xxx-xx-mkt-749805.pdf?src-supplier=Digi-Key; Supplier Part Number 1: 200-SSW12601GD
CN12 = External_Expansion_TestBoard_PC104: Conn Socket Strip SKT 52 POS 2.54mm Solder ST Thru-Hole; Manufacturer: Samtec; Manufacturer Part Number: SSW-126-01-G-D; Gender: Receptacle; Number of Contacts: 52; Connector Type: Receptacle,Socket; Mating Cycles: 100; Max Voltage Rating (AC): 550V; Max Current Rating: 5.5A; Contact Resistance: 10mR; Row Spacing: 0.1inch; Supplier 1: Mouser; RoHS: Yes; Category: Headers and Wire Housings; Stock 1: 72; Pricing 1: 1=6.95000, 10=6.17000, 25=5.80000, 100=5.30000, 250=4.64000, 500=4.22000 (USD); Mount: Through Hole; Contact Plating: Gold; Contact Material: Bronze; Color: Black; Housing Color: Black; Housing Material: Polymer; Min Operating Temperature: -55°C; Max Operating Temperature: 125°C; Termination: Solder; Number of Rows: 2; Number of Positions: 52; Packaging: Bulk; Orientation: Straight; Length: 66.55mm; Pitch: 2.54mm; Width: 4.95mm; Depth: 4.95mm; Lead Free: Lead Free; REACH SVHC: No SVHC; ComponentLink1URL: https://datasheet.ciiva.com/749/ssw-1xx-xx-xxx-x-xx-xxx-xx-mkt-749805.pdf?src-supplier=Digi-Key; ComponentLink1Description: https://datasheet.ciiva.com/749/ssw-1xx-xx-xxx-x-xx-xxx-xx-mkt-749805.pdf?src-supplier=Digi-Key; Supplier Part Number 1: 200-SSW12601GD
PC1 PC4 PC6 PC8 PC9 PC11 = Inner_SSW-126-01-G-D: 52 Position Receptacle Connector  Through Hole; Manufacturer: Samtec; Number of Contacts: 52; Connector Type: Receptacle,Socket; Mating Cycles: 100; Max Current Rating: 5.5A; Contact Resistance: 10mR; Max Voltage Rating (AC): 550V; Pitch: 2.54mm; Row Spacing: 0.1inch; Partnumber: SSW-126-01-G-D; Supplier 1: Mouser; Supplier Part Number 1: 200-SSW12601GD; Stock 1: 86; Pricing 1: 1=6.95, 10=5.8, 100=4.93, 250=4.4, 500=4.05, 1000=3.8 (USD); Mount: Through Hole; Contact Plating: Gold; Contact Material: Bronze; Color: Black; Housing Color: Black; Housing Material: Polymer; Min Operating Temperature: -55°C; Max Operating Temperature: 125°C; Number of Rows: 2; Termination: Solder; Gender: Receptacle; Packaging: Bulk; Number of Positions: 52; Orientation: Straight; Length: 66.55mm; Width: 4.95mm; Depth: 4.95mm; Lead Free: Lead Free; REACH SVHC: No SVHC; ComponentLink1URL: http://suddendocs.samtec.com/prints/ssw-1xx-xx-xxx-x-xx-xxx-xx-mkt.pdf?src-supplier=Digi-Key; ComponentLink1Description: http://suddendocs.samtec.com/prints/ssw-1xx-xx-xxx-x-xx-xxx-xx-mkt.pdf?src-supplier=Digi-Key; Supplier 2: Digi-Key; Supplier Part Number 2: SAM1208-26-ND; Stock 2: 0; Pricing 2: 1=6.69, 10=6.415, 25=5.8576, 50=5.5786, 100=5.2996, 250=4.74176, 500=4.46284 (USD); Manufacturer Part Number: SSW-126-01-G-D
PC2 PC3 PC5 PC7 PC10 PC12 = External_SSW-126-01-G-D_1: 52 Position Receptacle Connector  Through Hole; Manufacturer: Samtec; Number of Contacts: 52; Connector Type: Receptacle,Socket; Mating Cycles: 100; Max Current Rating: 5.5A; Contact Resistance: 10mR; Max Voltage Rating (AC): 550V; Pitch: 2.54mm; Row Spacing: 0.1inch; Partnumber: SSW-126-01-G-D; Supplier 1: Mouser; Supplier Part Number 1: 200-SSW12601GD; Stock 1: 86; Pricing 1: 1=6.95, 10=5.8, 100=4.93, 250=4.4, 500=4.05, 1000=3.8 (USD); Mount: Through Hole; Contact Plating: Gold; Contact Material: Bronze; Color: Black; Housing Color: Black; Housing Material: Polymer; Min Operating Temperature: -55°C; Max Operating Temperature: 125°C; Number of Rows: 2; Termination: Solder; Gender: Receptacle; Packaging: Bulk; Number of Positions: 52; Orientation: Straight; Length: 66.55mm; Width: 4.95mm; Depth: 4.95mm; Lead Free: Lead Free; REACH SVHC: No SVHC; ComponentLink1URL: http://suddendocs.samtec.com/prints/ssw-1xx-xx-xxx-x-xx-xxx-xx-mkt.pdf?src-supplier=Digi-Key; ComponentLink1Description: http://suddendocs.samtec.com/prints/ssw-1xx-xx-xxx-x-xx-xxx-xx-mkt.pdf?src-supplier=Digi-Key; Supplier 2: Digi-Key; Supplier Part Number 2: SAM1208-26-ND; Stock 2: 0; Pricing 2: 1=6.69, 10=6.415, 25=5.8576, 50=5.5786, 100=5.2996, 250=4.74176, 500=4.46284 (USD); Manufacturer Part Number: SSW-126-01-G-D
SW1 SW2 = 100SP1T1B4M2QE: E-SWITCH - 100SP1T1B4M2QE - SWITCH, TOGGLE, SPDT, 5A, 120VAC, 28VDC; Actuator Material: Brass,Chrome; Switch Function: On-On; Voltage Rating (AC): 120V; Voltage Rating (DC): 28V; Illumination Type: Non-Illuminated,Illuminated; Actuator Type: Standard Round; Electrical Life: 40000Cycles; Actuator Length: 12.19mm; Manufacturer: *; Mount Type: *; Action: *; Circuit: *; Supplier 1: Digi-Key; Manufacturer Part Number: 100SP1T1B4M2QE; RoHS: Yes; Category: Toggle Switches; Stock 1: 8901; Pricing 1: 1=1.99000, 10=1.77900, 25=1.68240, 50=1.60200, 100=1.52950, 250=1.46512, 500=1.36850, 1000=1.30410 (USD); Mount: Through Hole; Contact Material: Silver; Contact Plating: Silver; Min Operating Temperature: -30°C; Max Operating Temperature: 85°C; Package Quantity: 1; Current Rating: 5A; Packaging: Bulk; Orientation: Vertical; Termination: PC Pin; Throw Configuration: SPDT; Lead Free: Lead Free; ComponentLink1URL: https://datasheet.ciiva.com/24455/t111597-24455739.pdf?src-supplier=Onlinecomponents.com; ComponentLink1Description: https://datasheet.ciiva.com/24455/t111597-24455739.pdf?src-supplier=Onlinecomponents.com; ComponentLink2URL: https://datasheet.ciiva.com/2905/t111597-2905494.pdf?src-supplier=Digi-Key; ComponentLink2Description: https://datasheet.ciiva.com/2905/t111597-2905494.pdf?src-supplier=Digi-Key; Supplier Part Number 1: EG2355-ND; Value: *